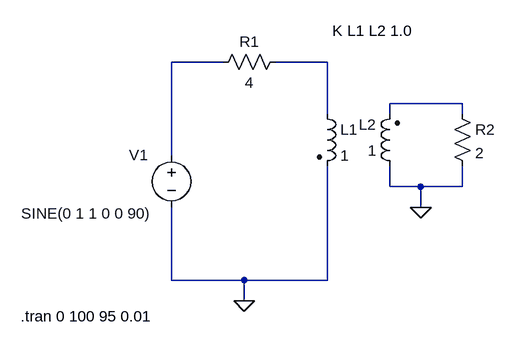
[diagram p0: schematic Induktivitate - v2.asc]
Induktivitate - v2.asc, the LTspice schematic file:
Version 4
SHEET 1 1156 680
WIRE 224 -32 144 -32
WIRE 384 -32 304 -32
WIRE 592 32 480 32
WIRE 384 48 384 -32
WIRE 480 48 480 32
WIRE 592 48 592 32
WIRE 144 112 144 -32
WIRE 480 160 480 128
WIRE 528 160 480 160
WIRE 592 160 592 128
WIRE 592 160 528 160
WIRE 528 192 528 160
WIRE 144 304 144 192
WIRE 256 304 144 304
WIRE 384 304 384 128
WIRE 384 304 256 304
WIRE 256 336 256 304
FLAG 256 336 0
FLAG 528 192 0
SYMBOL voltage 144 96 R0
WINDOW 0 -65 15 Left 2
WINDOW 3 -231 105 Left 2
WINDOW 123 0 0 Left 0
WINDOW 39 0 0 Left 0
SYMATTR InstName V1
SYMATTR Value SINE(0 1 1 0 0 90)
SYMBOL res 320 -48 R90
WINDOW 0 0 56 VBottom 2
WINDOW 3 32 56 VTop 2
SYMATTR InstName R1
SYMATTR Value 4
SYMBOL ind2 368 32 R0
SYMATTR InstName L1
SYMATTR Value 1
SYMATTR Type ind
SYMBOL ind2 496 144 R180
WINDOW 0 36 80 Left 2
WINDOW 3 36 40 Left 2
SYMATTR InstName L2
SYMATTR Value 1
SYMATTR Type ind
SYMBOL res 576 32 R0
SYMATTR InstName R2
SYMATTR Value 2
TEXT -88 360 Left 2 !.tran 0 100 95 0.01
TEXT 392 -80 Left 2 !K L1 L2 1.0

The netlist it stands for:
* Induktivitate - v2.asc
V1 N001 0 SINE(0 1 1 0 0 90)
R1 N002 N001 4
L1 N002 0 1
L2 0 N003 1
R2 N003 0 2
.tran 0 100 95 0.01
K L1 L2 1.0
.backanno
.end